# Altium schematic sheet ESP32-esp32-c3-mini-module.SchDoc: ESP32-C3-Mini Module
size A4; SheetNumber: 1; SheetTotal: 1
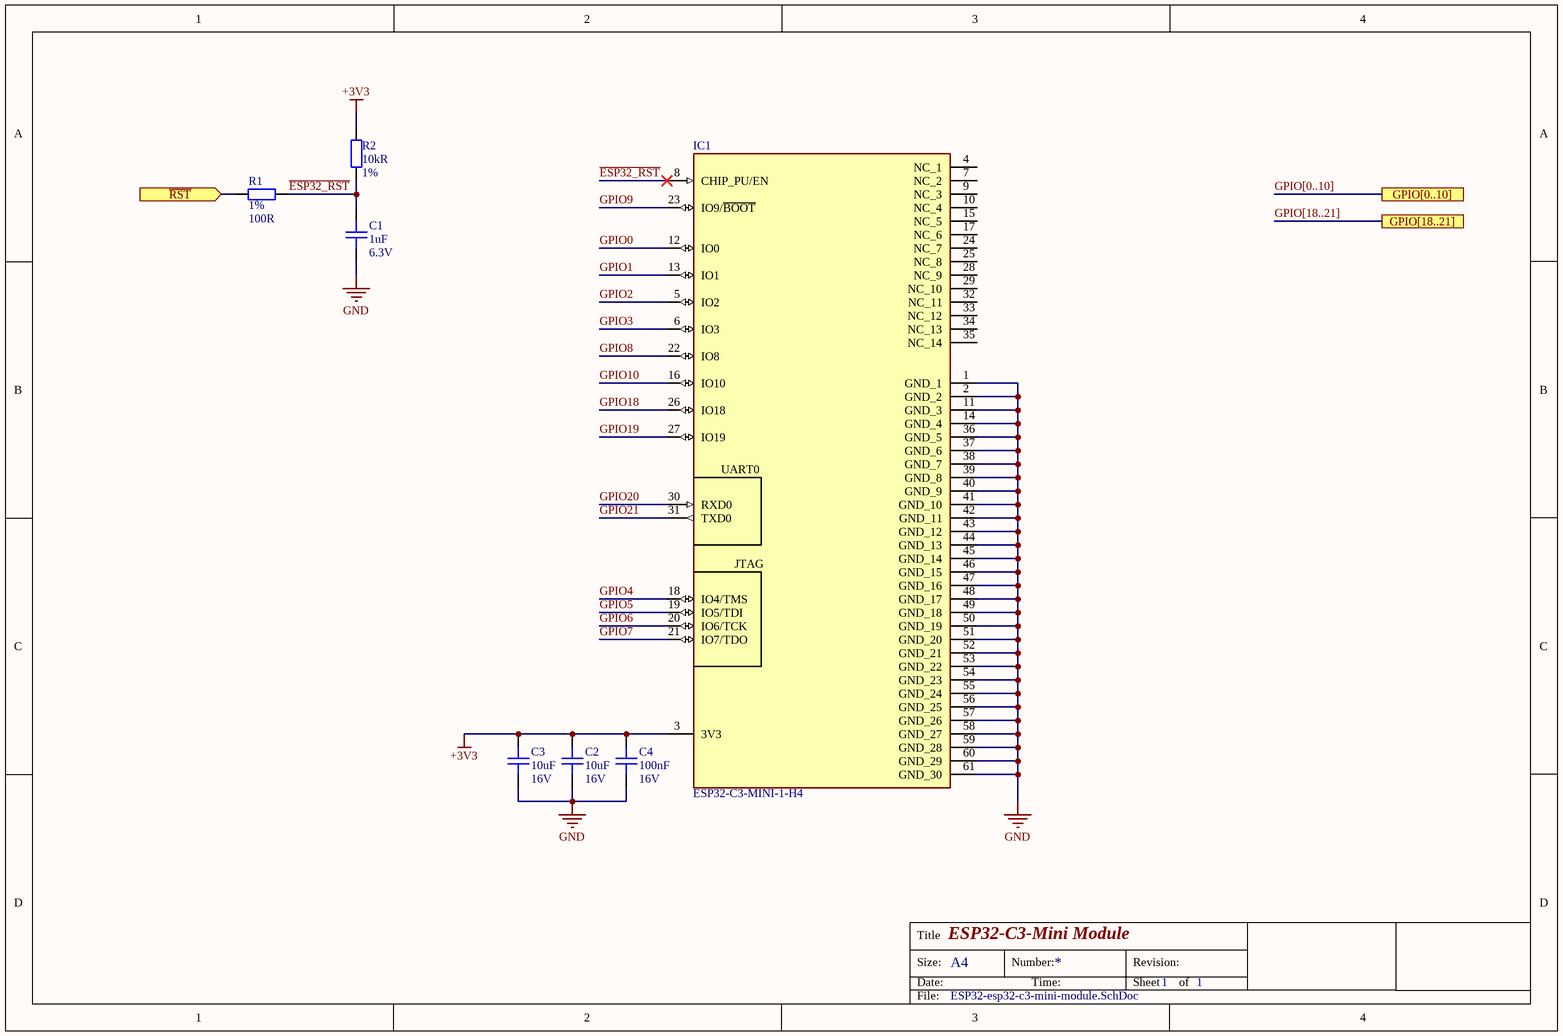
[diagram p0: ESP32-esp32-c3-mini-module.SchDoc]

## Parts
C1  Capacitance: 1uF  Voltage Rating: 6.3V  [C0402]  (hidden comment: CAP CER 1UF 6.3V X5R 0402)
C2  Capacitance: 10uF  Voltage Rating: 16V  [C0603]  (hidden comment: CAP CER 10UF 16V X5R 0603)
C3  Capacitance: 10uF  Voltage Rating: 16V  [C0603]  (hidden comment: CAP CER 10UF 16V X5R 0603)
C4  Capacitance: 100nF  Voltage: 16V  [C0402]  (hidden comment: CAP CER 0.1UF 16V X7R 0402)
IC1  ESP32-C3-MINI-1-H4  [ESP32C3MINI1H4]
R1  Tolerance: 1%  Resistance: 100R  [R0402]  (hidden comment: RES SMD 100 OHM 1% 1/16W 0402)
R2  Resistance: 10kR  Tolerance: 1%  [R0402]  (hidden comment: RES SMD 10K OHM 1% 1/16W 0402)

## Ports
GPIO[0..10], GPIO[18..21], ~{RST} (in)

## Nets
+3V3: C2.2 C3.2 C4.2 IC1.3(3V3) R2.1
GND: C1.1 C2.1 C3.1 C4.1 IC1.1(GND_1) IC1.2(GND_2) IC1.11(GND_3) IC1.14(GND_4) IC1.36(GND_5) IC1.37(GND_6) IC1.38(GND_7) IC1.39(GND_8) IC1.40(GND_9) IC1.41(GND_10) IC1.42(GND_11) IC1.43(GND_12) IC1.44(GND_13) IC1.45(GND_14) IC1.46(GND_15) IC1.47(GND_16) IC1.48(GND_17) IC1.49(GND_18) IC1.50(GND_19) IC1.51(GND_20) IC1.52(GND_21) IC1.53(GND_22) IC1.54(GND_23) IC1.55(GND_24) IC1.56(GND_25) IC1.57(GND_26) IC1.58(GND_27) IC1.59(GND_28) IC1.60(GND_29) IC1.61(GND_30)
~{ESP32_RST}: C1.2 IC1.8(CHIP_PU/EN) R1.1 R2.2
~{RST}: R1.2 ; port ~{RST}
GPIO0: IC1.12(IO0)
GPIO1: IC1.13(IO1)
GPIO2: IC1.5(IO2)
GPIO3: IC1.6(IO3)
GPIO4: IC1.18(IO4/TMS)
GPIO5: IC1.19(IO5/TDI)
GPIO6: IC1.20(IO6/TCK)
GPIO7: IC1.21(IO7/TDO)
GPIO8: IC1.22(IO8)
GPIO9: IC1.23(IO9/~{BOOT})
GPIO10: IC1.16(IO10)
GPIO18: IC1.26(IO18)
GPIO19: IC1.27(IO19)
GPIO20: IC1.30(RXD0)
GPIO21: IC1.31(TXD0)

Not connected (* = marked no-connect by the designer): IC1 4(NC_1) 7(NC_2) 9(NC_3) 10(NC_4) 15(NC_5) 17(NC_6) 24(NC_7) 25(NC_8) 28(NC_9) 29(NC_10) 32(NC_11) 33(NC_12) 34(NC_13) 35(NC_14)

## Buses and harness runs
bus GPIO[0..10] = port GPIO[0..10]
bus GPIO[18..21] = port GPIO[18..21]

## Notes on the sheet
- Title
- Size:
- Date:
- A4
- Number:
- Time:
- Revision:
- Sheet
- of
- File:
- (in symbol ESP32-C3-MINI-1-H4) UART0; JTAG

## Library data of the parts
C1 = CAP CER 1UF 6.3V X5R 0402: 1µF ±10% 6.3V Ceramic Capacitor X5R 0402 (1005 Metric); Manufacturer: Yageo; Manufacturer Part Number: CC0402KRX5R5BB105; Supplier 1: Digi-Key; Stock 1: 34926286; Pricing 1: 1=0.1, 10=0.05, 50=0.0272, 100=0.0222, 500=0.0158, 1000=0.0124, 2500=0.0113, 5000=0.0104 (USD); Mount: Surface Mount; Number of Pins: 2; Case Code (Imperial): 0402; Case Code (Metric): 1005; Min Operating Temperature: -55°C; Max Operating Temperature: 85°C; Tolerance: 10%; Packaging: Tape and Reel; Termination: SMD/SMT; Voltage Rating (DC): 6.3V; Composition: Ceramic; Length: 1mm; Height: 0.5mm; Width: 0.02inch; Thickness: 0.022inch; Depth: 0.5mm; Radiation Hardening: No; Lead Free: Lead Free; Halogen Free: Halogen Free; ComponentLink1URL: http://www.farnell.com/datasheets/70765.pdf?src-supplier=Farnell; ComponentLink1Description: http://www.farnell.com/datasheets/70765.pdf?src-supplier=Farnell; Supplier Part Number 1: 311-1438-1-ND; Dielectric: X5R; Case/Package: 0402; Dielectric Material: Ceramic; Package Quantity: 1; REACH SVHC: No SVHC; ComponentLink2URL: http://www.yageo.com/documents/recent/UPY-GPHC_X5R_4V-to-50V_25.pdf?src-supplier=Digi-Key; ComponentLink2Description: http://www.yageo.com/documents/recent/UPY-GPHC_X5R_4V-to-50V_25.pdf?src-supplier=Digi-Key; ComponentLink3URL: http://www.farnell.com/datasheets/2167237.pdf?src-supplier=Element14; ComponentLink3Description: http://www.farnell.com/datasheets/2167237.pdf?src-supplier=Element14; ComponentLink4URL: http://www.yageo.com/documents/recent/UPY-GPHC_X5R_4V-to-50V_12.pdf?src-supplier=Avnet+Europe; ComponentLink4Description: http://www.yageo.com/documents/recent/UPY-GPHC_X5R_4V-to-50V_12.pdf?src-supplier=Avnet+Europe; ComponentLink5URL: http://www.farnell.com/datasheets/1359354.pdf?src-supplier=Element14; ComponentLink5Description: http://www.farnell.com/datasheets/1359354.pdf?src-supplier=Element14; ComponentLink6URL: http://www.farnell.com/datasheets/70765.pdf?src-supplier=Element14; ComponentLink6Description: http://www.farnell.com/datasheets/70765.pdf?src-supplier=Element14; ComponentLink7URL: http://www.yageo.com/documents/recent/UPY-GPHC_X5R_4V-to-50V_12.pdf?src-supplier=Avnet; ComponentLink7Description: http://www.yageo.com/documents/recent/UPY-GPHC_X5R_4V-to-50V_12.pdf?src-supplier=Avnet
C2 C3 = CAP CER 10UF 16V X5R 0603: 10µF ±10% 16V Ceramic Capacitor X5R 0603 (1608 Metric); Manufacturer: Murata; Manufacturer Part Number: GRM188R61C106KAALJ; Supplier 1: Digi-Key; Stock 1: 5470; Pricing 1: 1=0.39, 10=0.271, 100=0.1628, 500=0.1221, 1000=0.1031, 2500=0.0977, 5000=0.0923 (USD); Mount: Surface Mount; Case/Package: 0603; Case Code (Imperial): 0603; Case Code (Metric): 1608; Min Operating Temperature: -55°C; Max Operating Temperature: 85°C; Tolerance: 10%; Dielectric: X5R; Voltage Rating (DC): 16V; Packaging: Tape and Reel; Package Quantity: 10000; Termination: SMD/SMT; Length: 0.063inch; Height: 0.8mm; Width: 0.031inch; Thickness: 0.037inch; Supplier Part Number 1: 490-12736-1-ND; Weight: 0.000222oz; Composition: Ceramic
C4 = CAP CER 0.1UF 16V X7R 0402: 0.1µF ±10% 16V Ceramic Capacitor X7R 0402 (1005 Metric); Manufacturer Part Number: CC0402KRX7R7BB104; Manufacturer: Yageo; Revision: July-2002: Re-released for DXP Platform.; Order: CC0402KRX7R7BB104; Supplier 1: Digi-Key; Stock 1: 25916830; Pricing 1: 1=0.1, 10=0.031, 100=0.0136, 500=0.0097, 1000=0.0077, 2500=0.007, 5000=0.0064 (USD); Mount: Surface Mount; Number of Pins: 2; Case Code (Metric): 1005; Case Code (Imperial): 0402; Min Operating Temperature: -55°C; Max Operating Temperature: 125°C; Tolerance: 10%; Dielectric: X7R; Voltage Rating: 16V; Voltage Rating (DC): 16V; Packaging: Tape and Reel; Package Quantity: 1; Termination: SMD/SMT; Composition: Ceramic; Length: 1mm; Height: 0.5mm; Width: 0.02inch; Thickness: 0.022inch; Depth: 0.5mm; Radiation Hardening: No; REACH SVHC: No SVHC; Lead Free: Lead Free; Halogen Free: Halogen Free; ComponentLink1URL: http://www.yageo.com/documents/recent/UPY-GPHC_X7R_6.3V-to-50V_8.pdf?src-supplier=Avnet+Europe; ComponentLink1Description: http://www.yageo.com/documents/recent/UPY-GPHC_X7R_6.3V-to-50V_8.pdf?src-supplier=Avnet+Europe; ComponentLink2URL: http://www.yageo.com/documents/recent/UPY-GPHC_X7R_6.3V-to-50V_18.pdf?src-supplier=Digi-Key; ComponentLink2Description: http://www.yageo.com/documents/recent/UPY-GPHC_X7R_6.3V-to-50V_18.pdf?src-supplier=Digi-Key; ComponentLink3URL: http://www.yageo.com/documents/recent/UPY-GPHC_X7R_6.3V-to-50V_8.pdf?src-supplier=Avnet; ComponentLink3Description: http://www.yageo.com/documents/recent/UPY-GPHC_X7R_6.3V-to-50V_8.pdf?src-supplier=Avnet; ComponentLink4URL: http://www.yageo.com/documents/recent/UPY-GPHC_X7R_6.3V-to-50V_18.pdf?src-supplier=Mouser; ComponentLink4Description: http://www.yageo.com/documents/recent/UPY-GPHC_X7R_6.3V-to-50V_18.pdf?src-supplier=Mouser; ComponentLink5URL: http://www.farnell.com/datasheets/2167236.pdf?src-supplier=Element14; ComponentLink5Description: http://www.farnell.com/datasheets/2167236.pdf?src-supplier=Element14; ComponentLink6URL: http://www.farnell.com/datasheets/1489800.pdf?src-supplier=Element14; ComponentLink6Description: http://www.farnell.com/datasheets/1489800.pdf?src-supplier=Element14; Supplier Part Number 1: 311-1338-1-ND
IC1 = ESP32-C3-MINI-1-H4: Integrated Circuit; Manufacturer_Name: Espressif Systems; Datasheet Link: https://www.mouser.es/datasheet/2/891/Espressif_ESP32_C3_MINI_1_Datasheet-2006822.pdf; Height: 2.55mm; Manufacturer_Part_Number: ESP32-C3-MINI-1-H4
R1 = RES SMD 100 OHM 1% 1/16W 0402: 100 Ohms ±1% 0.063W, 1/16W Chip Resistor 0402 (1005 Metric) Moisture Resistant Thick Film; Manufacturer Part Number: RC0402FR-07100RL; Manufacturer: Yageo; Power Rating: 62.5mW; Voltage Rating: 50V; Temperature Coefficient: 100ppm/°C; Supplier 1: Digi-Key; Stock 1: 16989760; Pricing 1: 1=0.1, 10=0.016, 100=0.0064, 1000=0.0029, 2500=0.0025, 5000=0.0021 (USD); Case/Package: 0402; Number of Pins: 2; Case Code (Imperial): 0402; Case Code (Metric): 1005; Min Operating Temperature: -55°C; Max Operating Temperature: 155°C; Voltage Rating (DC): 50V; Packaging: Tape and Reel; Termination: SMD/SMT; Composition: Thick Film; Military Standard: Not; Length: 1mm; Height: 0.32mm; Width: 0.5mm; Depth: 0.5mm; REACH SVHC: No SVHC; Lead Free: Lead Free; ComponentLink1URL: http://www.farnell.com/datasheets/2167052.pdf?src-supplier=Element14; ComponentLink1Description: http://www.farnell.com/datasheets/2167052.pdf?src-supplier=Element14; ComponentLink2URL: http://www.yageo.com/documents/recent/PYu-RC_Group_51_RoHS_L_9.pdf?src-supplier=Mouser; ComponentLink2Description: http://www.yageo.com/documents/recent/PYu-RC_Group_51_RoHS_L_9.pdf?src-supplier=Mouser; ComponentLink3URL: http://www.yageo.com/documents/recent/PYu-RC0402_51_RoHS_L_6_r.pdf?src-supplier=Future+Electronics; ComponentLink3Description: http://www.yageo.com/documents/recent/PYu-RC0402_51_RoHS_L_6_r.pdf?src-supplier=Future+Electronics; ComponentLink4URL: https://www.verical.com/server-webapp/html/getDatasheet?partID=329466&src-supplier=Verical; ComponentLink4Description: https://www.verical.com/server-webapp/html/getDatasheet?partID=329466&src-supplier=Verical; ComponentLink5URL: http://www.farnell.com/datasheets/1018594.pdf?src-supplier=Element14; ComponentLink5Description: http://www.farnell.com/datasheets/1018594.pdf?src-supplier=Element14; ComponentLink6URL: http://documents.rs-components.com/techlib://itc_doclist_GB.htm?stockno=6185810&src-supplier=RSComponents; ComponentLink6Description: http://documents.rs-components.com/techlib://itc_doclist_GB.htm?stockno=6185810&src-supplier=RSComponents; Supplier Part Number 1: 311-100LRDKR-ND; Mount: Surface Mount
R2 = RES SMD 10K OHM 1% 1/16W 0402: 10 kOhms ±1% 0.063W, 1/16W Chip Resistor 0402 (1005 Metric) Moisture Resistant Thick Film; Manufacturer Part Number: RC0402FR-0710KP; Manufacturer: Yageo; Temperature Coefficient: 150ppm/°C; Max Power Dissipation: 63mW; Supplier 1: Digi-Key; Stock 1: 839368; Pricing 1: 1=0.1, 10=0.035, 100=0.014, 1000=0.0063, 2500=0.0055, 5000=0.0045 (USD); Case Code (Imperial): 0402; Case Code (Metric): 1005; Min Operating Temperature: -55°C; Max Operating Temperature: 155°C; Composition: Thick Film; Packaging: Tape and Reel; Number of Terminations: 2; Length: 0.039inch; Height: 0.016inch; Width: 0.02inch; ComponentLink1URL: http://www.yageo.com/NewPortal/yageodocoutput?fileName=/pdf/R-Chip/PYu-RC_51_RoHS_P_0.pdf&src-supplier=Digi-Key; ComponentLink1Description: http://www.yageo.com/NewPortal/yageodocoutput?fileName=/pdf/R-Chip/PYu-RC_51_RoHS_P_0.pdf&src-supplier=Digi-Key; Supplier Part Number 1: YAG1249CT-ND; Case/Package: 0402; Features: Moisture Resistant; Mount: Surface Mount